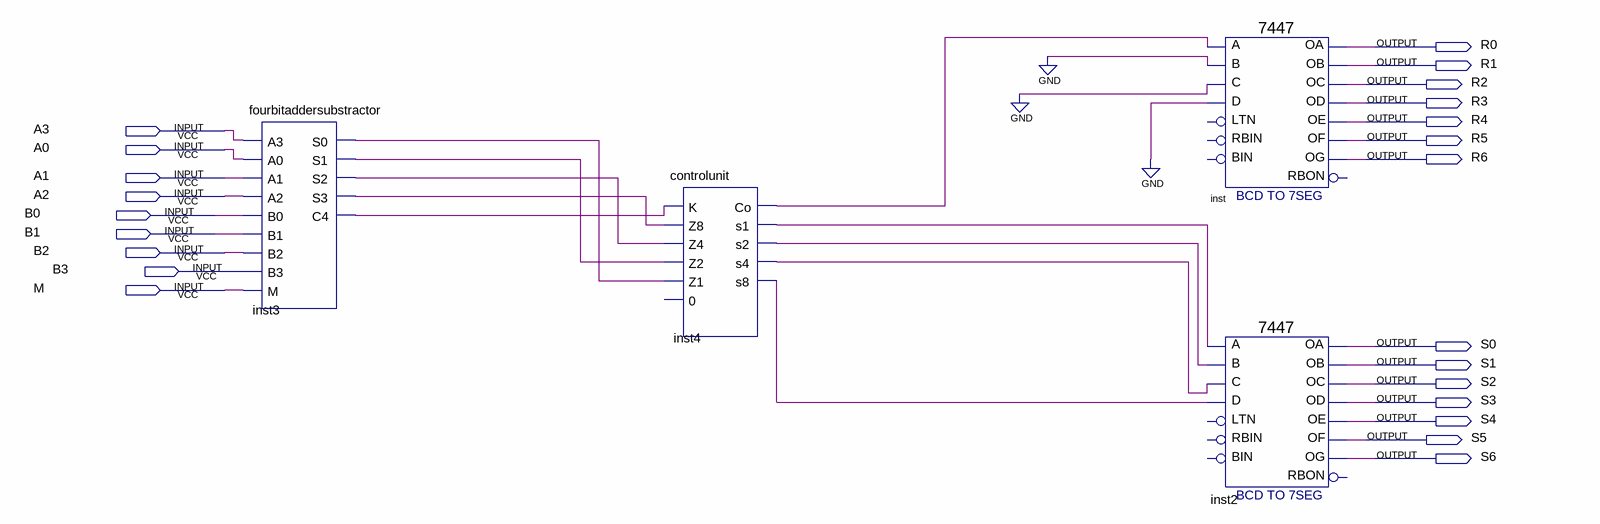
[diagram p0: schematic sheet]
// Quartus schematic lab3.bdf as structural Verilog: 4 symbols, 23 pins
module lab3 (
  input  A3,
  input  A0,
  input  A1,
  input  A2,
  input  B0,
  input  B1,
  input  B2,
  input  B3,
  input  M,
  output R0,
  output R1,
  output R2,
  output R3,
  output R4,
  output R5,
  output R6,
  output S0,
  output S1,
  output S2,
  output S3,
  output S4,
  output S5,
  output S6
);

  wire inst3_c4, inst3_s0, inst3_s1, inst3_s2, inst3_s3, inst4_co, inst4_s1, inst4_s2, inst4_s4, inst4_s8;

  fourbitaddersubstractor inst3 (
    .A3(A3), .A0(A0), .A1(A1), .A2(A2), .B0(B0), .B1(B1), .B2(B2), .B3(B3), .M(M), .S0(inst3_s0),
    .S1(inst3_s1), .S2(inst3_s2), .S3(inst3_s3), .C4(inst3_c4));
  controlunit inst4 (
    .K(inst3_c4), .Z8(inst3_s3), .Z4(inst3_s2), .Z2(inst3_s1), .Z1(inst3_s0), .Co(inst4_co), .s1(inst4_s1),
    .s2(inst4_s2), .s4(inst4_s4), .s8(inst4_s8));  // open: 0
  \7447  inst (
    .B(1'b0), .C(1'b0), .D(1'b0), .A(inst4_co), .OB(R1), .OC(R2), .OE(R4), .OD(R3), .OF(R5), .OG(R6), .OA(R0));  // open: LTN, RBIN, BIN, RBON
  \7447  inst2 (
    .B(inst4_s2), .C(inst4_s4), .D(inst4_s8), .A(inst4_s1), .OB(S1), .OC(S2), .OE(S4), .OD(S3), .OF(S5),
    .OG(S6), .OA(S0));  // open: LTN, RBIN, BIN, RBON
endmodule
